# EAGLE schematic Signalwandler (EAGLE 7.5.0)
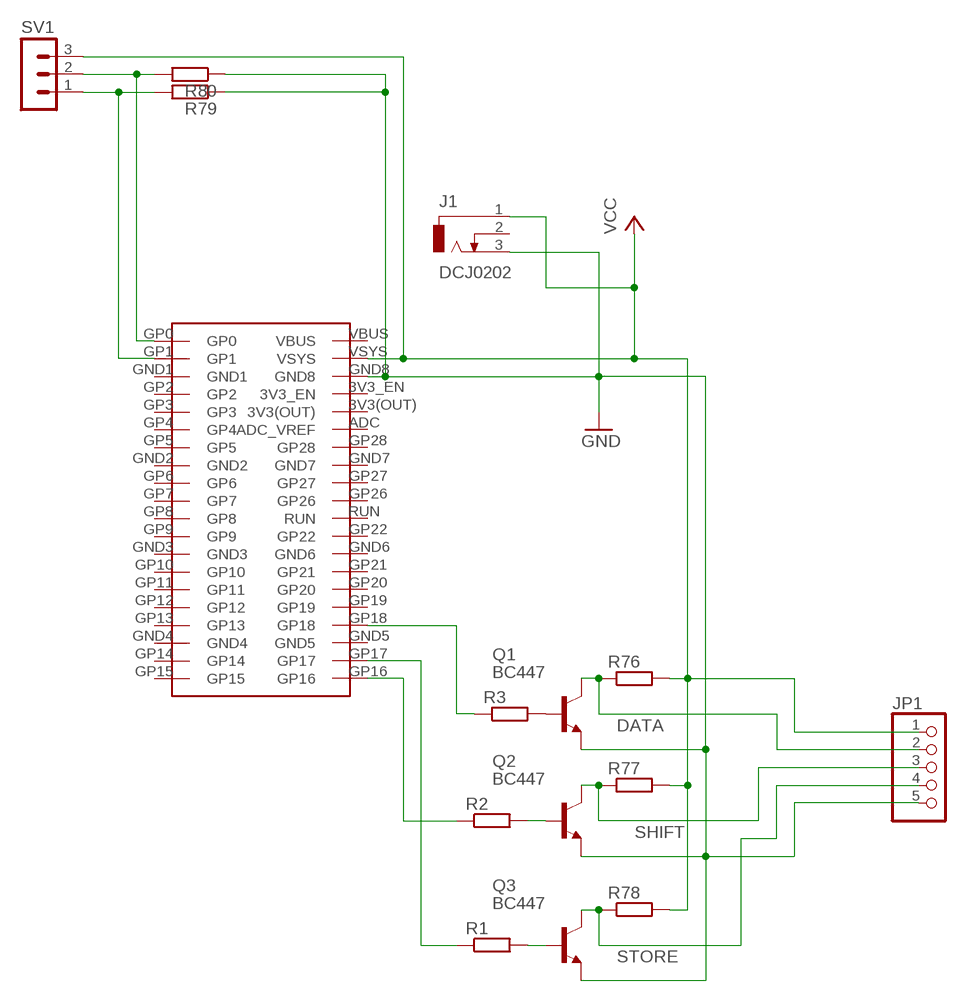
[diagram p0: schematic, sheet 1]

## Parts
J1  DCJ0202  [DCJ0202]
JP1  PINHD-1X5  [1X05]
Q1  BC447  [TO92-EBC]
Q2  BC447  [TO92-EBC]
Q3  BC447  [TO92-EBC]
R1  R-EU_0207/10  [0207/10]
R2  R-EU_0207/10  [0207/10]
R3  R-EU_0207/10  [0207/10]
R76  R-EU_0207/10  [0207/10]
R77  R-EU_0207/10  [0207/10]
R78  R-EU_0207/10  [0207/10]
R79  R-EU_0207/10  [0207/10]
R80  R-EU_0207/10  [0207/10]
SV1  MA03-1  [MA03-1]
U$2  PI_PICO  [PI_PICO]

## Nets
DATA: JP1.2 Q1.C R76.1
GND: J1.3 JP1.5 Q1.E Q2.E Q3.E R79.1 R80.1 U$2.GND8
N$1: R1.1 U$2.GP17
N$2: Q3.B R1.2
N$4: Q2.B R2.2
N$5: Q1.B R3.2
N$6: R3.1 U$2.GP18
N$7: R2.1 U$2.GP16
N$41: R80.2 SV1.2 U$2.GP0
N$43: R79.2 SV1.1 U$2.GP1
SHIFT: JP1.3 Q2.C R77.1
STORE: JP1.4 Q3.C R78.1
VCC: J1.1 JP1.1 R76.2 R77.2 R78.2 SV1.3 U$2.VSYS
Unconnected: J1.2 U$2.3V3(OUT) U$2.3V3_EN U$2.ADC(ADC_VREF) U$2.GND1 U$2.GND2 U$2.GND3 U$2.GND4 U$2.GND5 U$2.GND6 U$2.GND7 U$2.GP2 U$2.GP3 U$2.GP4 U$2.GP5 U$2.GP6 U$2.GP7 U$2.GP8 U$2.GP9 U$2.GP10 U$2.GP11 U$2.GP12 U$2.GP13 U$2.GP14 U$2.GP15 U$2.GP19 U$2.GP20 U$2.GP21 U$2.GP22 U$2.GP26 U$2.GP27 U$2.GP28 U$2.RUN U$2.VBUS

## Library data of the parts
J1 = con-jack:DCJ0202: DC POWER JACK Source: DCJ0202.pdf; OC_FARNELL: unknown; OC_NEWARK: unknown
JP1 = pinhead:PINHD-1X5: PIN HEADER
Q1-Q3 = transistor-npn:BC447*: NPN Transistor
R1-R3 R76-R80 = rcl:R-EU_: RESISTOR, European symbol; SPICEPREFIX: R
SV1 = con-lstb:MA03-1: PIN HEADER; OC_FARNELL: unknown; OC_NEWARK: unknown
U$2 = PI_PICO:PI_PICO